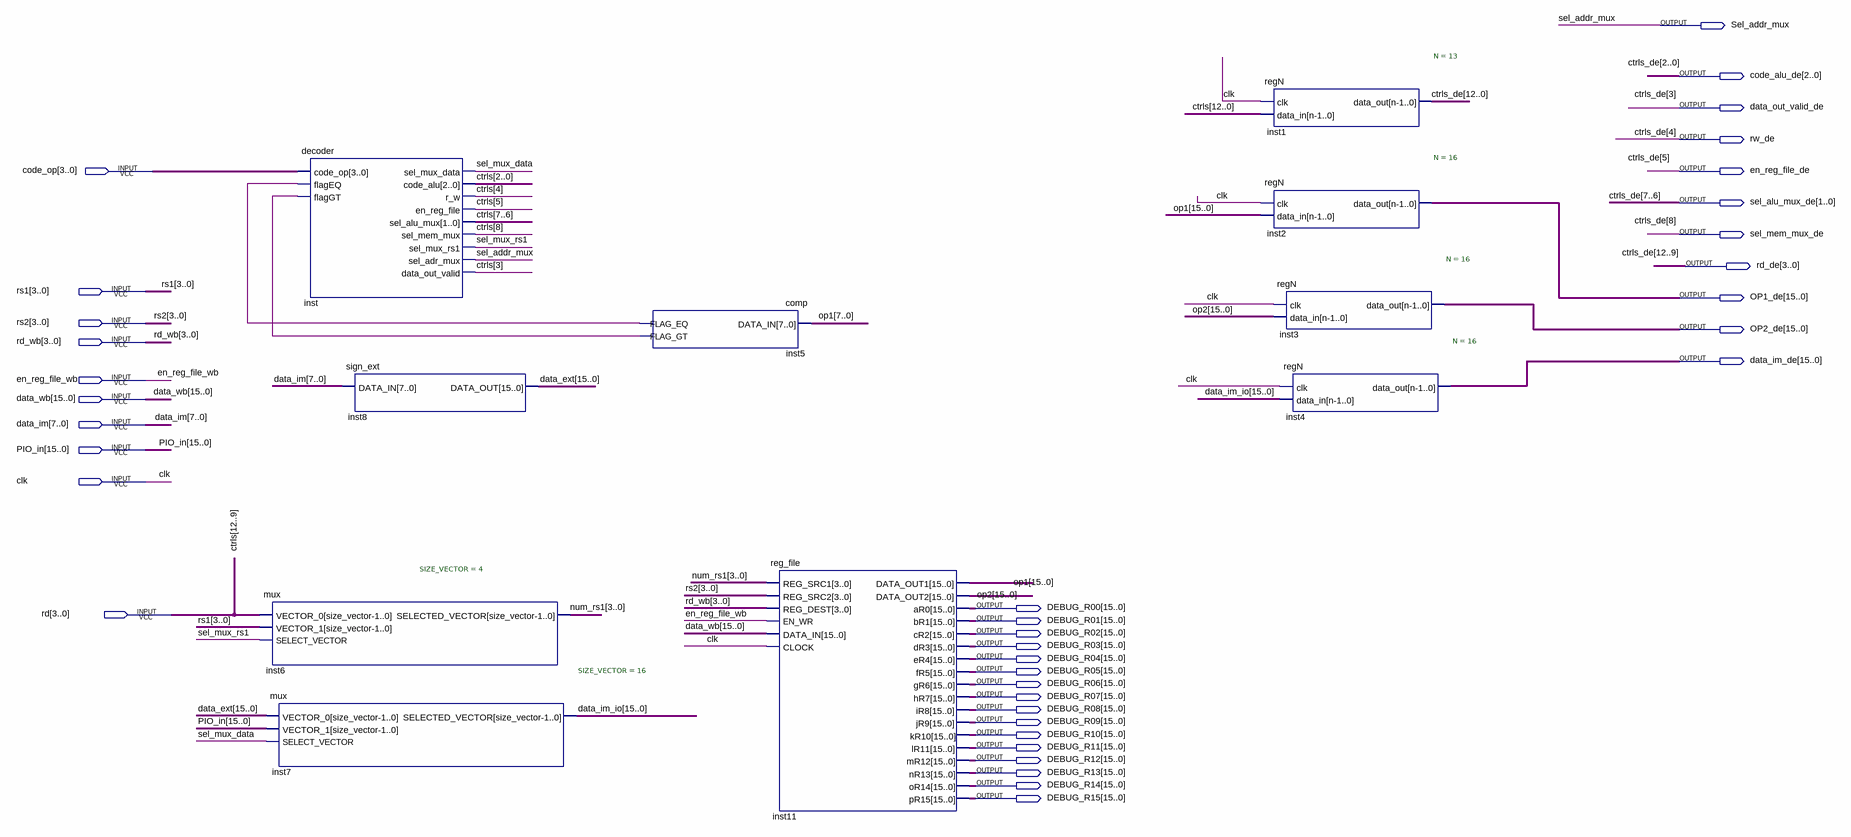
[diagram p0: schematic sheet]
// Quartus schematic DEStage.bdf as structural Verilog: 10 symbols, 37 pins
module DEStage (
  input  [3:0] code_op,
  input  [3:0] rs1,
  input  [3:0] rs2,
  input  [3:0] rd_wb,
  input  en_reg_file_wb,
  input  [15:0] data_wb,
  input  [7:0] data_im,
  input  [15:0] PIO_in,
  input  clk,
  input  [3:0] rd,
  output Sel_addr_mux,
  output [2:0] code_alu_de,
  output data_out_valid_de,
  output rw_de,
  output en_reg_file_de,
  output [1:0] sel_alu_mux_de,
  output sel_mem_mux_de,
  output [3:0] rd_de,
  output [15:0] OP1_de,
  output [15:0] OP2_de,
  output [15:0] data_im_de,
  output [15:0] DEBUG_R00,
  output [15:0] DEBUG_R01,
  output [15:0] DEBUG_R02,
  output [15:0] DEBUG_R03,
  output [15:0] DEBUG_R04,
  output [15:0] DEBUG_R05,
  output [15:0] DEBUG_R06,
  output [15:0] DEBUG_R07,
  output [15:0] DEBUG_R08,
  output [15:0] DEBUG_R09,
  output [15:0] DEBUG_R10,
  output [15:0] DEBUG_R11,
  output [15:0] DEBUG_R12,
  output [15:0] DEBUG_R13,
  output [15:0] DEBUG_R14,
  output [15:0] DEBUG_R15
);

  wire inst5_flag_eq, inst5_flag_gt, sel_mux_data, sel_mux_rs1;
  wire [3:0] num_rs1;
  wire [8:0] ctrls;
  wire [15:0] data_ext, data_im_io, op1, op2;

  mux #(.SIZE_VECTOR(4)) inst6 (.VECTOR_0(rd), .VECTOR_1(rs1), .SELECT_VECTOR(sel_mux_rs1), .SELECTED_VECTOR(num_rs1));
  decoder inst (
    .code_op(code_op), .flagEQ(inst5_flag_eq), .flagGT(inst5_flag_gt), .sel_mux_data(sel_mux_data),
    .code_alu(ctrls[2:0]), .r_w(ctrls[4]), .en_reg_file(ctrls[5]), .sel_alu_mux(ctrls[7:6]),
    .sel_mem_mux(ctrls[8]), .sel_mux_rs1(sel_mux_rs1), .sel_adr_mux(Sel_addr_mux), .data_out_valid(ctrls[3]));
  mux #(.SIZE_VECTOR(16)) inst7 (
    .VECTOR_0(data_ext), .VECTOR_1(PIO_in), .SELECT_VECTOR(sel_mux_data), .SELECTED_VECTOR(data_im_io));
  sign_ext inst8 (.DATA_IN(data_im), .DATA_OUT(data_ext));
  comp inst5 (.DATA_IN(op1[7:0]), .FLAG_EQ(inst5_flag_eq), .FLAG_GT(inst5_flag_gt));
  reg_file inst11 (
    .REG_SRC1(num_rs1), .REG_SRC2(rs2), .REG_DEST(rd_wb), .EN_WR(en_reg_file_wb), .DATA_IN(data_wb),
    .CLOCK(clk), .DATA_OUT1(op1), .DATA_OUT2(op2), .aR0(DEBUG_R00), .bR1(DEBUG_R01), .cR2(DEBUG_R02),
    .dR3(DEBUG_R03), .eR4(DEBUG_R04), .fR5(DEBUG_R05), .gR6(DEBUG_R06), .hR7(DEBUG_R07), .iR8(DEBUG_R08),
    .jR9(DEBUG_R09), .kR10(DEBUG_R10), .lR11(DEBUG_R11), .mR12(DEBUG_R12), .nR13(DEBUG_R13),
    .oR14(DEBUG_R14), .pR15(DEBUG_R15));
  regN #(.N(13)) inst1 (
    .clk(clk), .data_in({rd, ctrls}),
    .data_out({rd_de, sel_mem_mux_de, sel_alu_mux_de, en_reg_file_de, rw_de, data_out_valid_de, code_alu_de}));
  regN #(.N(16)) inst2 (.clk(clk), .data_in(op1), .data_out(OP1_de));
  regN #(.N(16)) inst3 (.clk(clk), .data_in(op2), .data_out(OP2_de));
  regN #(.N(16)) inst4 (.clk(clk), .data_in(data_im_io), .data_out(data_im_de));

  // Other names for the same wires on the sheet: ctrls[12:9] = rd;
  //   ctrls_de[12:0] = {rd_de, sel_mem_mux_de, sel_alu_mux_de, en_reg_file_de, rw_de, data_out_valid_de, code_alu_de}
endmodule
